# Altium schematic sheet MOSFET.SchDoc
size B; SheetNumber: 2; SheetTotal: 6
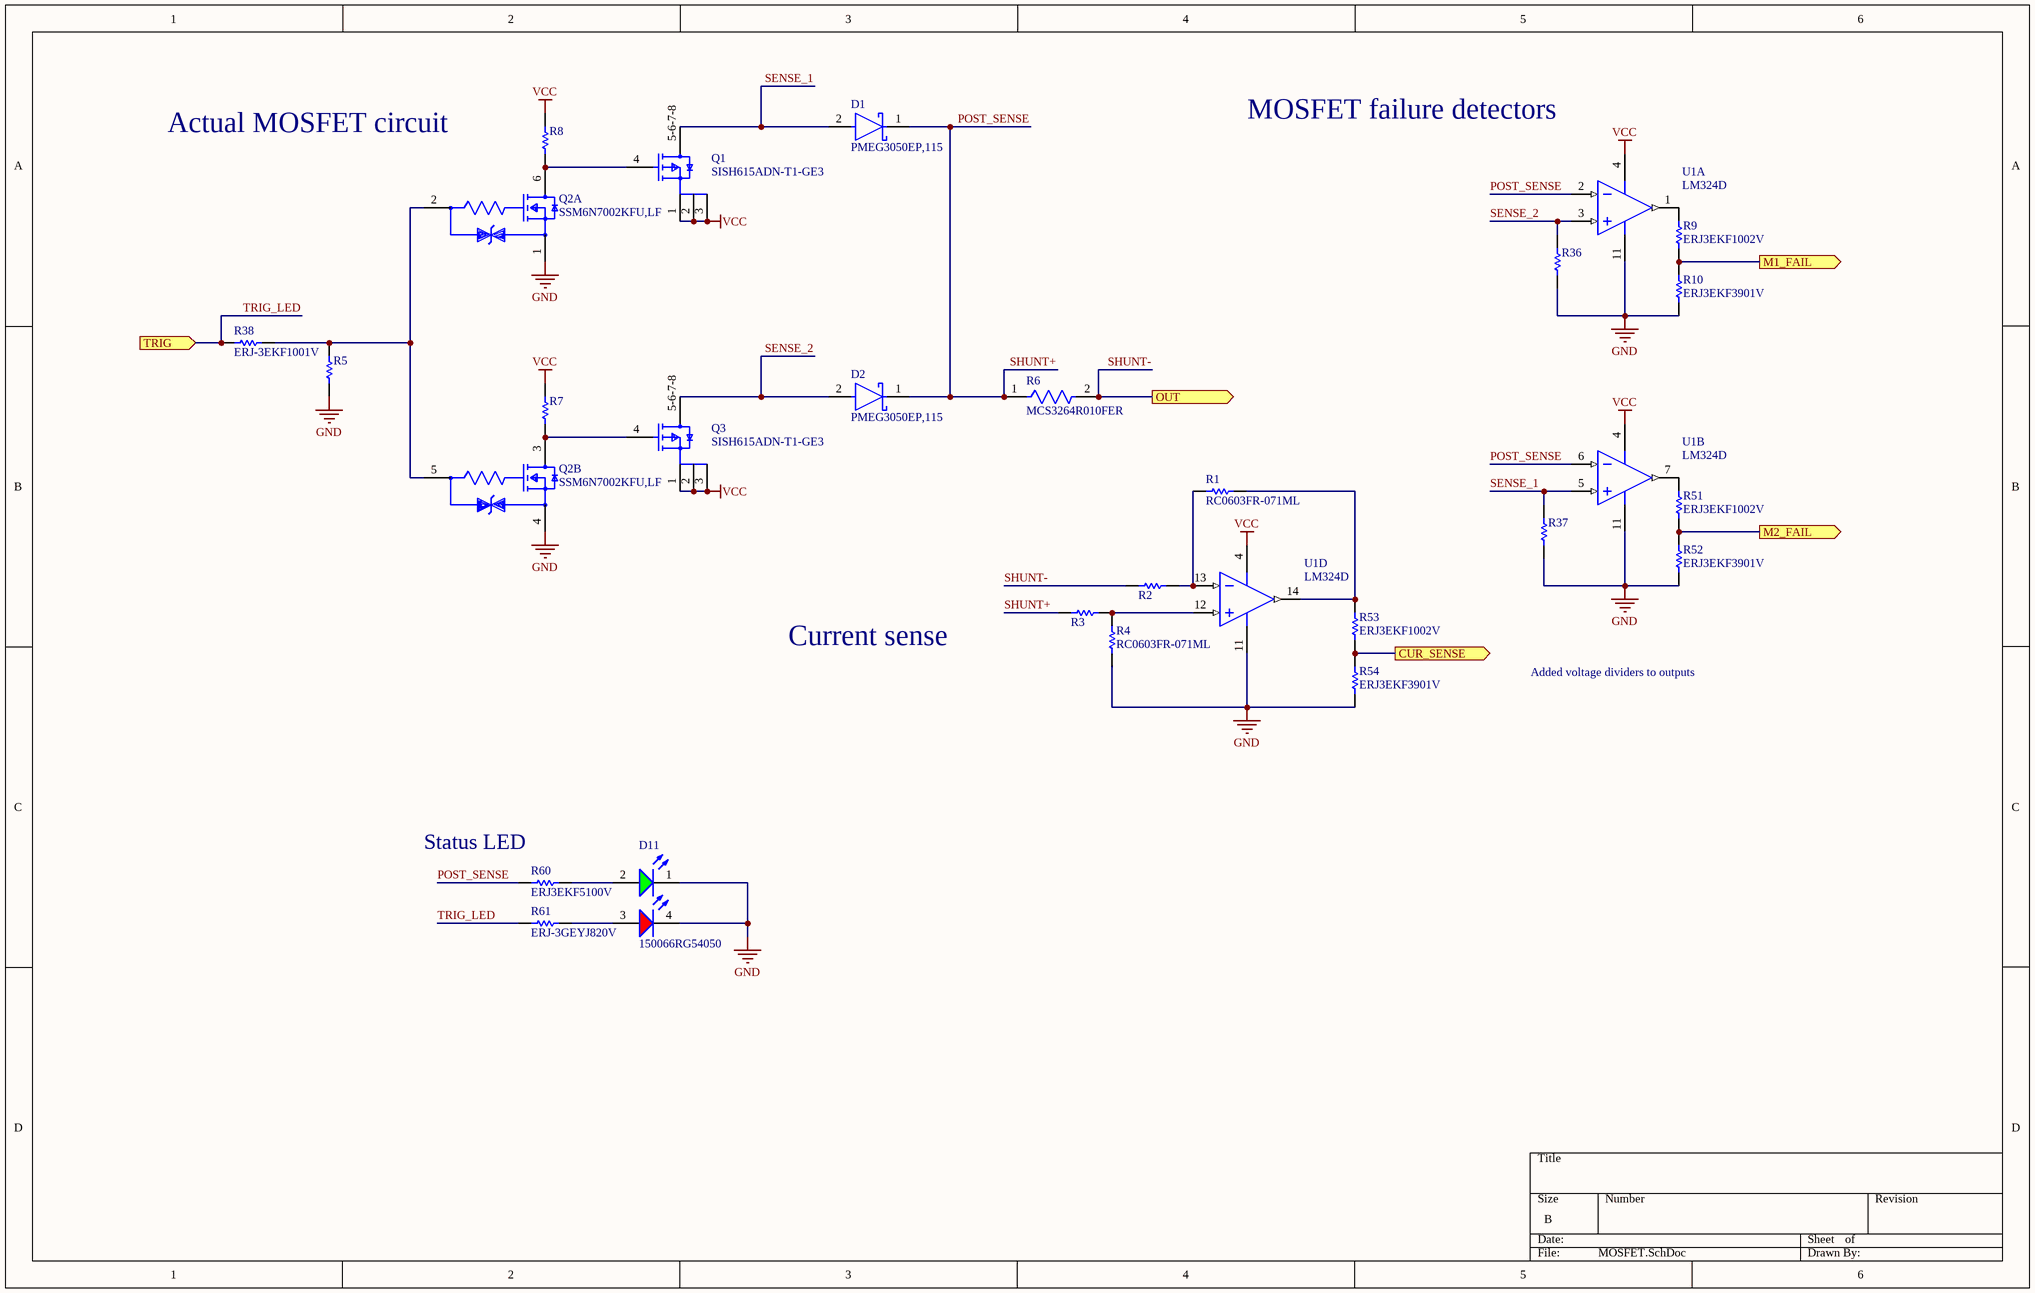
[diagram p0: MOSFET.SchDoc]

## Parts
D1  PMEG3050EP,115  [FP-SOD128-MFG]
D2  PMEG3050EP,115  [FP-SOD128-MFG]
D11  150066RG54050  [WL-SBCD_0606]
Q1  SISH615ADN-T1-GE3  [SISH615ADN-T1-GE3-Footprint-1]
Q2  SSM6N7002KFU,LF  [FP-SSOP6-P-0_65A-MFG]  (parts A,B of 2)
Q3  SISH615ADN-T1-GE3  [SISH615ADN-T1-GE3-Footprint-1]
R1  RC0603FR-071ML  [RESC1608X55X25LL10T15]
R2  ERJ3EKF1002V  [RESC1609X55X30LL15T15]  (value not drawn)
R3  ERJ3EKF1002V  [RESC1609X55X30LL15T15]  (value not drawn)
R4  RC0603FR-071ML  [RESC1608X55X25LL10T15]
R5  ERJ3EKF1002V  [RESC1609X55X30LL15T15]  (value not drawn)
R6  MCS3264R010FER  [FP-MCS3264-MFG]
R7  ERJ3EKF1002V  [RESC1609X55X30LL15T15]  (value not drawn)
R8  ERJ3EKF1002V  [RESC1609X55X30LL15T15]  (value not drawn)
R9  ERJ3EKF1002V  [RESC1609X55X30LL15T15]
R10  ERJ3EKF3901V  [RESC1608X55X30ML15T15]
R36  ERJ-3EKF1003V  [RESC1608X55X30ML15T15]  (value not drawn)
R37  ERJ-3EKF1003V  [RESC1608X55X30ML15T15]  (value not drawn)
R38  ERJ-3EKF1001V  [RESC1608X55X30LL15T15]
R51  ERJ3EKF1002V  [RESC1609X55X30LL15T15]
R52  ERJ3EKF3901V  [RESC1608X55X30ML15T15]
R53  ERJ3EKF1002V  [RESC1609X55X30LL15T15]
R54  ERJ3EKF3901V  [RESC1608X55X30ML15T15]
R60  ERJ3EKF5100V  [RESC1608X55X30NL15T15]
R61  ERJ-3GEYJ820V  [RESC1608X55X30NL15T15]
U1  LM324D  [D0014A_L]  (parts A,B,D of 4)

## Ports
CUR_SENSE (out, see LightLink_V3[5A]), M1_FAIL (out, see LightLink_V3[5A]), M2_FAIL (out, see LightLink_V3[5A]), OUT (out, see LightLink_V3[5A]), TRIG (in, see LightLink_V3[5A])

## Nets
GND: D11.1(K) D11.4(K) Q2.1(Source1) Q2.4(Source2) R4.1 R5.1 R10.1 R36.1 R37.1 R52.1 R54.1 U1.11(GND)
VCC: Q1.1(S) Q1.2(S) Q1.3(S) Q3.1(S) Q3.2(S) Q3.3(S) R7.2 R8.2 U1.4(VCC)
CUR_SENSE: R53.1 R54.2 ; port CUR_SENSE
M1_FAIL: R9.1 R10.2 ; port M1_FAIL
M2_FAIL: R51.1 R52.2 ; port M2_FAIL
POST_SENSE: D1.1(C) D2.1(C) R3.2 R6.1 R60.1 U1.2(1IN-) U1.6(2IN-)  [also labelled SHUNT+]
SENSE_1: D1.2(A) Q1.5-6-7-8(D) R37.2 U1.5(2IN+)
SENSE_2: D2.2(A) Q3.5-6-7-8(D) R36.2 U1.3(1IN+)
SHUNT-: R2.2 R6.2 ; port OUT
TRIG_LED: R38.1 R61.1 ; port TRIG
NetD11_2: D11.2(A) R60.2
NetD11_3: D11.3(A) R61.2
NetQ1_4: Q1.4(G) Q2.6(Drain1) R8.1
NetQ2_2: Q2.2(Gate1) Q2.5(Gate2) R5.2 R38.2
NetQ2_3: Q2.3(Drain2) Q3.4(G) R7.1
NetR1_1: R1.1 R2.1 U1.13(4IN-)
NetR1_2: R1.2 R53.2 U1.14(4OUT)
NetR3_1: R3.1 R4.2 U1.12(4IN+)
NetR9_2: R9.2 U1.1(1OUT)
NetR51_2: R51.2 U1.7(2OUT)

## Notes on the sheet
- Actual MOSFET circuit
- MOSFET failure detectors
- Current sense
- Added voltage dividers to outputs
- (near R60) Status LED

## Library data of the parts
D1 D2 = CMP-14398-000051-1: DIODE SCHOTTKY 30V 5A SOD128; RoHS Compliant: Yes
D11 = CMP-004-00034-2: Led, Red/Grn, 180Mcd/230Mcd, 624Nm/525Nm Rohs Compliant: Yes
Q1 Q3 = CMP-013-00036-2: Trans MOSFET P-CH 20V 22.1A 8-Pin PowerPAK 1212 EP T/R
Q2 = CMP-35916-000009-1: MOSFET 2N-CH 60V 0.3A; Input Capacitance: 40pF; Continuous Drain Current (ID): 300mA; Max Power Dissipation: 285mW; FET Type: 2 N-Channel; Rds On Max: 1.5R; Mount: Surface Mount; Drain to Source Voltage (Vdss): 60V; Packaging: Tape and Reel
R1 R4 = CMP-1659-00056-1: Chip Resistor, 1 MOhm, +/- 1%, 100 mW, -55 to 155 degC, 0603 (1608 Metric), RoHS, Tape and Reel; Voltage Rating (DC): 25 V; Tolerance: 20%; Case\Package: Radial; Capacitance: 1 mF; Min Operating Temperature: -40 degC; PackageDescription: 2-Pin Surface Mount Device, Body 1.6 x 0.8 mm; ComponentLink1Description: Manufacturer URL; Radiation Hardening: No; DatasheetVersion: Rev. 4, 02/2016; REACH SVHC: No SVHC; Length: 20 mm; Max Operating Temperature: 85 degC; Diameter: 10 mm; Packaging: Bulk; Package Quantity: 200; PackageReference: 0603; Mount: Through Hole; ComponentLink1URL: http://www.yageo.com/; ComponentLink2URL: http://www.yageo.com/documents/recent/PYu-RC_Group_51_RoHS_L_04.pdf; ComponentLink2Description: Datasheet; Width: 0 inch; Lead Pitch: 5 mm; RoHSCompliant: true; Voltage Rating: 25 V; Height: 20 mm
R2 R3 R5 R7-R9 R51 R53 = CMP-1012-00623-3: Chip Resistor, 10 KOhm, +/- 1%, 0.1 W, -55 to 155 degC, 0603 (1608 Metric), RoHS, Tape and Reel; Manufacturer: Panasonic; Voltage Rating: 75V; Case\/Package: 0603; Power Rating: 100mW; Resistance: 10KOhm; Temperature Coefficient: 100ppm\/degreesC; Number of Pins: 2; Package Reference: 603; Depth: 0.8mm; Mount: SurfaceMount; Package Description: 2-Pin Surface Mount Device, Body 1.6 x 0.85 mm; Datasheet Version: 02/2017; Length: 1.6mm; Lead Free: LeadFree; Height: 0.45mm; Number of Terminations: 2; Max Power Dissipation: 100mW; Min Operating Temperature: -55degC; Datasheet URL: https://industrial.panasonic.com/cdbs/www-data/pdf/RDA0000/AOA0000C304.pdf; Termination: SMD/SMT; Case Code (Metric): 1608; Case Code (Imperial): 0603; Tolerance: 1%; Max Operating Temperature: 155degC; RoHSCompliant: true; Voltage Rating (DC): 75V; Radiation Hardening: No; Packaging: TapeandReel; Composition: ThickFilm; Mounting Technology: SurfaceMount; Manufacturer URL: http://www.panasonic.com/; Width: 0.031inch; REACH SVHC: NoSVHC; Contact Plating: Tin; Military Standard: Not; Package Quantity: 1
R6 = CMP-33361-000012-1: RES SMD 10 MOHM 1% 2W 3264; Temperature Coefficient: 50ppm/°C; Resistance: 10mR; Voltage Rating: 220mV; Case/Package: 2512; Military Standard: Not; Max Operating Temperature: 150°C; Height: 0.024inch; Package Quantity: 1; Case Code (Imperial): 2512; Number of Terminations: 2; Features: Flame Retardant Coating; Width: 0.126inch; Tolerance: 1%; Composition: Metal Element; Number of Pins: 2; Packaging: Tape and Reel; Depth: 3.2mm; Termination: SMD/SMT; Min Operating Temperature: -55°C; Power Rating: 2W; Case Code (Metric): 6432; Max Power Dissipation: 2W; Mount: Surface Mount; Length: 6.4mm
R10 R52 R54 = CMP-2000-00475-1: Manufacturer: Panasonic; Part Number: ERJ3EKF3901V
R36 R37 = CMP-2000-00182-1: Manufacturer: Panasonic; Part Number: ERJ-3EKF1003V
R38 = CMP-2000-00180-1: Manufacturer: Panasonic; Part Number: ERJ-3EKF1001V
R60 = CMP-2000-00539-1: Manufacturer: Panasonic; Part Number: ERJ3EKF5100V
R61 = CMP-1012-00048-2: Manufacturer: Panasonic; Part Number: ERJ-3GEYJ820V
U1 = CMP-2000-06547-1: Quadruple Operational Amplifier, 0.5 V/us, 1.2 MHz, 3 to 32 V, 0 to 70 degC, 14-Pin SOIC (D), Green (RoHS & no Sb/Br), Tube; Manufacturer: Texas Instruments; Unity Gain Bandwidth Product: 1.2MHz; Input Offset Voltage: 7mV; Dual Supply Voltage (Max): ±16V; Single Supply Voltage (Min): 3V; Single Supply Voltage (Max): 32V; Voltage Gain in dB: 100dB; Power Supply Requirement: Single/Dual; Input Bias Current: 250nA; Dual Supply Voltage (Min): ±1.5V; Single Supply Voltage (Typ): 5/9/12/15/18/24/28V; Dual Supply Voltage (Typ): ±3/±5/±9/±12/±15V; Number of  Elements: 4; Common Mode Rejection Ratio: 65dB; Datasheet Version: Rev. W, 03/2015; Technology: Bipolar; Shut Down Feature: No; Package Reference: D0014A; Type: GeneralPurposeAmplifier; Pin Count: 14; Package Type: SOIC; Rail/Rail I/O Type: No; Manufacturer URL: http://www.ti.com/; Package Description: 14-Pin Small Outline Integrated Circuit, Body 8.65 x 3.9 mm, Pitch 1.27 mm; Operating Temperature Classification: Commercial; Datasheet URL: http://www.ti.com/lit/ds/symlink/lm324.pdf; Slew Rate: 0.5V/us; Package URL: http://www.ti.com/lit/ml/mpds177g/mpds177g.pdf; Mounting: SurfaceMount; Packaging: Rail/Tube; Mounting Technology: SurfaceMount; Operating Temp Range: 0Cto70C